# EAGLE design perfect_cubev2 (EAGLE 9.5.1)
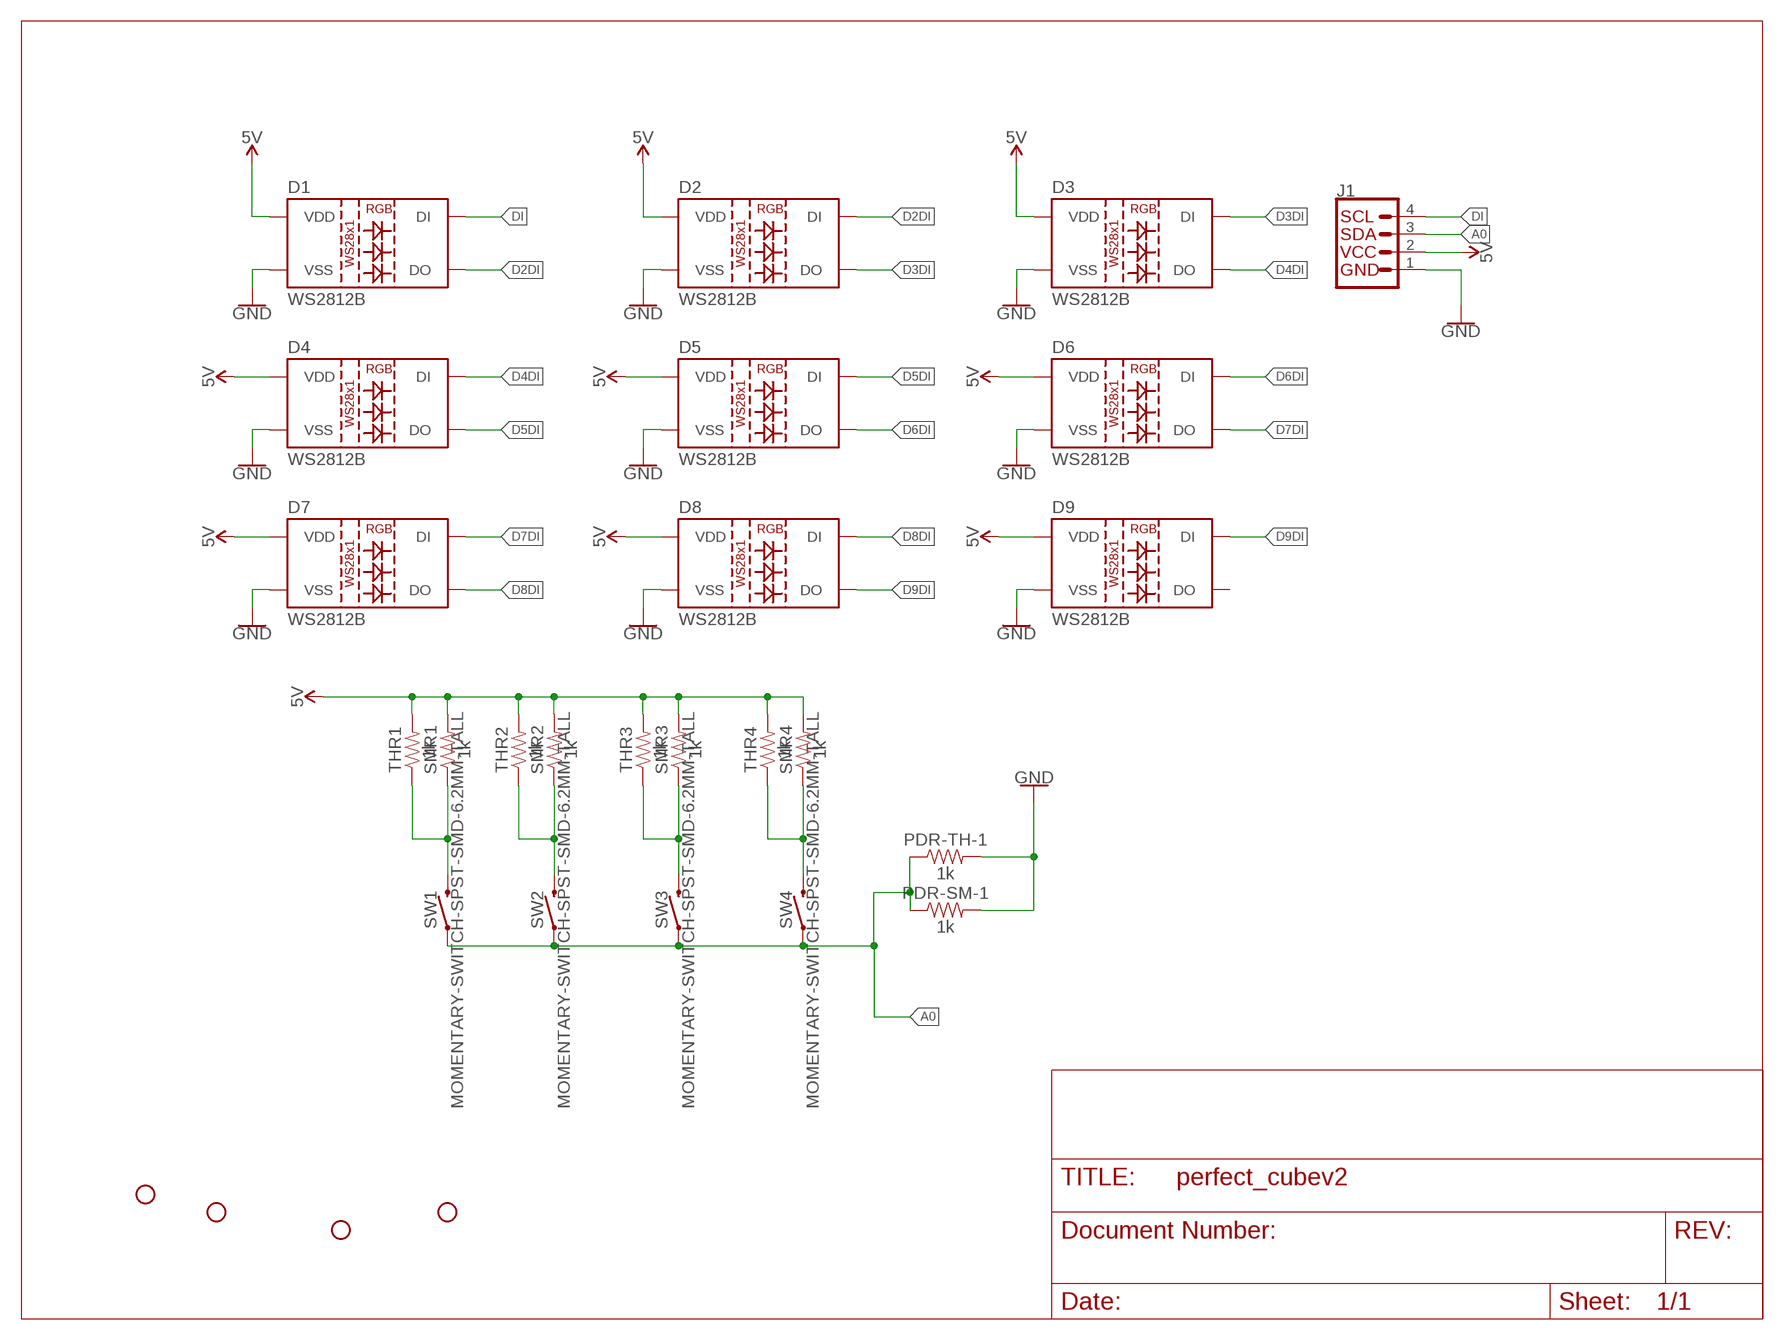
[diagram p0: schematic, sheet 1]

## Parts
D1  WS2812B  [WS2812B]
D2  WS2812B  [WS2812B]
D3  WS2812B  [WS2812B]
D4  WS2812B  [WS2812B]
D5  WS2812B  [WS2812B]
D6  WS2812B  [WS2812B]
D7  WS2812B  [WS2812B]
D8  WS2812B  [WS2812B]
D9  WS2812B  [WS2812B]
H1  STAND-OFF  [STAND-OFF]
H2  STAND-OFF  [STAND-OFF]
H3  STAND-OFF  [STAND-OFF]
H4  STAND-OFF  [STAND-OFF]
J1  QWIIC_CONNECTORJS-1MM  [1X04_1MM_RA]
PDR-SM-1  1k  1KOHM-0603-1/10W-1%  [0603]
PDR-TH-1  1k  1KOHM-HORIZ-1/4W-1%  [AXIAL-0.3]
SMR1  1k  1KOHM-0603-1/10W-1%  [0603]
SMR2  1k  1KOHM-0603-1/10W-1%  [0603]
SMR3  1k  1KOHM-0603-1/10W-1%  [0603]
SMR4  1k  1KOHM-0603-1/10W-1%  [0603]
SW1  MOMENTARY-SWITCH-SPST-SMD-6.2MM-TALL  [TACTILE_SWITCH_SMD_6.2MM_TALL]
SW2  MOMENTARY-SWITCH-SPST-SMD-6.2MM-TALL  [TACTILE_SWITCH_SMD_6.2MM_TALL]
SW3  MOMENTARY-SWITCH-SPST-SMD-6.2MM-TALL  [TACTILE_SWITCH_SMD_6.2MM_TALL]
SW4  MOMENTARY-SWITCH-SPST-SMD-6.2MM-TALL  [TACTILE_SWITCH_SMD_6.2MM_TALL]
THR1  1k  1KOHM-HORIZ-1/4W-1%  [AXIAL-0.3]
THR2  1k  1KOHM-HORIZ-1/4W-1%  [AXIAL-0.3]
THR3  1k  1KOHM-HORIZ-1/4W-1%  [AXIAL-0.3]
THR4  1k  1KOHM-HORIZ-1/4W-1%  [AXIAL-0.3]

## Nets
5V: D1.1(VDD) D2.1(VDD) D3.1(VDD) D4.1(VDD) D5.1(VDD) D6.1(VDD) D7.1(VDD) D8.1(VDD) D9.1(VDD) J1.2(VCC) SMR1.2 SMR2.2 SMR3.2 SMR4.2 THR1.P$2 THR2.P$2 THR3.P$2 THR4.P$2
A0: J1.3(SDA) PDR-SM-1.1 PDR-TH-1.P$1 SW1.A2 SW2.A2 SW3.A2 SW4.A2
D2DI: D1.2(DO) D2.4(DI)
D3DI: D2.2(DO) D3.4(DI)
D4DI: D3.2(DO) D4.4(DI)
D5DI: D4.2(DO) D5.4(DI)
D6DI: D5.2(DO) D6.4(DI)
D7DI: D6.2(DO) D7.4(DI)
D8DI: D7.2(DO) D8.4(DI)
D9DI: D8.2(DO) D9.4(DI)
DI: D1.4(DI) J1.4(SCL)
GND: D1.3(VSS) D2.3(VSS) D3.3(VSS) D4.3(VSS) D5.3(VSS) D6.3(VSS) D7.3(VSS) D8.3(VSS) D9.3(VSS) J1.1(GND) PDR-SM-1.2 PDR-TH-1.P$2
N$1: SMR1.1 SW1.B2 THR1.P$1
N$3: SMR2.1 SW2.B2 THR2.P$1
N$4: SMR3.1 SW3.B2 THR3.P$1
N$5: SMR4.1 SW4.B2 THR4.P$1
Unconnected: D9.2(DO)

## Library data of the parts
D1-D9 = SparkFun-LED:WS2812B: WS2812B SMD addressable RGB LED 5x5mm SMD LED with built-in controller IC. Color: Red/Green/Blue mC Rating: RGB: 390, 660, 180 mcd Forward Voltage: RGB: 2.0, 3.0, 3.0 V Packages:WS2812B SparkFun Products: Blynk Board - ESP8266 <https://www.sparkfun.com/products/13794>; PROD_ID: DIO-12503
H1-H4 = SparkFun-Hardware:STAND-OFF: Stand Off Drill holes for mechanically mounting via screws, standoffs, etc. Note: Use the keepout ring to avoid running the screw head into surrounding components. Variant Overviews STAND-OFF - Mechanical footprint for a #4 phillips button head screw. STAND-OFF-TIGHT - Mechanical footprint for a #4 phillips button head screw, Example SparkFun Products Screw - Phillips Head (1/4", 4-40, 10 pack) <https://www.sparkfun.com/products/10453> (PRT-10453) Screw - Phillips Head (1/2", 4-40, 10 pack) <https://www.sparkfun.com/products/10452> (PRT-10452) Screw - Phillips Head (3/4", 4-40, 10 pack) <https://www.sparkfun.com/products/10451> (PRT-10451) Screw - Phillips Head (1", 4-40, 10 pack) <https://www.sparkfun.com/products/10450> (PRT-10450)
J1 = SparkFun-Connectors:QWIIC_CONNECTOR: SparkFun I2C Standard Qwiic Connector An SMD 1mm pitch JST connector makes it easy and quick (get it? Qwiic?) to connect I2C devices to each other. The Qwiic system <http://www.sparkfun.com/qwiic> enables fast and solderless connection between popular platforms and various sensors and actuators. We carry 200mm <https://www.sparkfun.com/products/14204>, 100mm <https://www.sparkfun.com/products/14205>, 50mm <https://www.sparkfun.com/products/14206>, and breadboard friendly <https://www.sparkfun.com/products/14207> Qwiic cables. We also offer 10 pcs strips <https://www.sparkfun.com/products/14323> the SMD connectors.
PDR-SM-1 SMR1-SMR4 = SparkFun-Resistors:1KOHM: 1kΩ resistor A resistor is a passive two-terminal electrical component that implements electrical resistance as a circuit element. Resistors act to reduce current flow, and, at the same time, act to lower voltage levels within circuits. - Wikipedia; PROD_ID: RES-07856
PDR-TH-1 THR1-THR4 = SparkFun-Resistors:1KOHM: 1kΩ resistor A resistor is a passive two-terminal electrical component that implements electrical resistance as a circuit element. Resistors act to reduce current flow, and, at the same time, act to lower voltage levels within circuits. - Wikipedia; PROD_ID: RES-12182
SW1-SW4 = SparkFun-Switches:MOMENTARY-SWITCH-SPST: Momentary Switch (Pushbutton) - SPST Normally-open (NO) SPST momentary switches (buttons, pushbuttons). Variants PTH-12MM - 12mm square, through-hole Momentary Pushbutton Switch - 12mm Square <https://www.sparkfun.com/products/9190> (COM-09190) PTH-6.0MM, PTH-6.0MM-KIT - 6.0mm square, through-hole Mini Pushbutton Switch <https://www.sparkfun.com/products/97> (COM-00097) KIT package intended for soldering kit's - only one side of pads' copper is exposed. PTH-RIGHT-ANGLE-KIT - Right-angle, through-hole Right Angle Tactile Button <https://www.sparkfun.com/products/10791> - Used on SparkFun BigTime Watch Kit <https://www.sparkfun.com/products/11734> SMD-12MM - 12mm square, surface-mount Tactile Button - SMD (12mm) <https://www.sparkfun.com/products/12993> (COM-12993) Used on SparkFun PicoBoard <https://www.sparkfun.com/products/11888> SMD-4.5MM - 4.5mm Square Trackball Switch Used on SparkFun Blackberry Trackballer Breakout <https://www.sparkfun.com/products/13169> SMD-4.6MMX2.8MM - 4.60mm x 2.80mm, surface mount Used on SparkFun SAMD21 Mini Breakout <https://www.sparkfun.com/products/13664> SMD-5.2MM, SMD-5.2-REDUNDANT - 5.2mm square, surface-mount Mini Pushbutton Switch - SMD <https://www.sparkfun.com/products/8720> (COM-08720) Used on Arduino Pro Mini <https://www.sparkfun.com/products/11114> REDUNDANT package connects both switch circuits together SMD-6.0X3.5MM - 6.0 x 3.5mm, surface mount Momentary Reset Switch SMD <https://www.sparkfun.com/products/8229> (COM-08229) SMD-6.2MM-TALL - 6.2mm square, surface mount Tactile Button - SMD (6mm) <https://www.sparkfun.com/products/12992> Used on SparkFun Digital Sandbox <https://www.sparkfun.com/products/12651> SMD-RIGHT-ANGLE - Right-angle, surface mount Used on SparkFun Block for Intel® Edison - Arduino <https://www.sparkfun.com/products/13036>; PROD_ID: SWCH-11966; SF_SKU: COM-12992

## Board
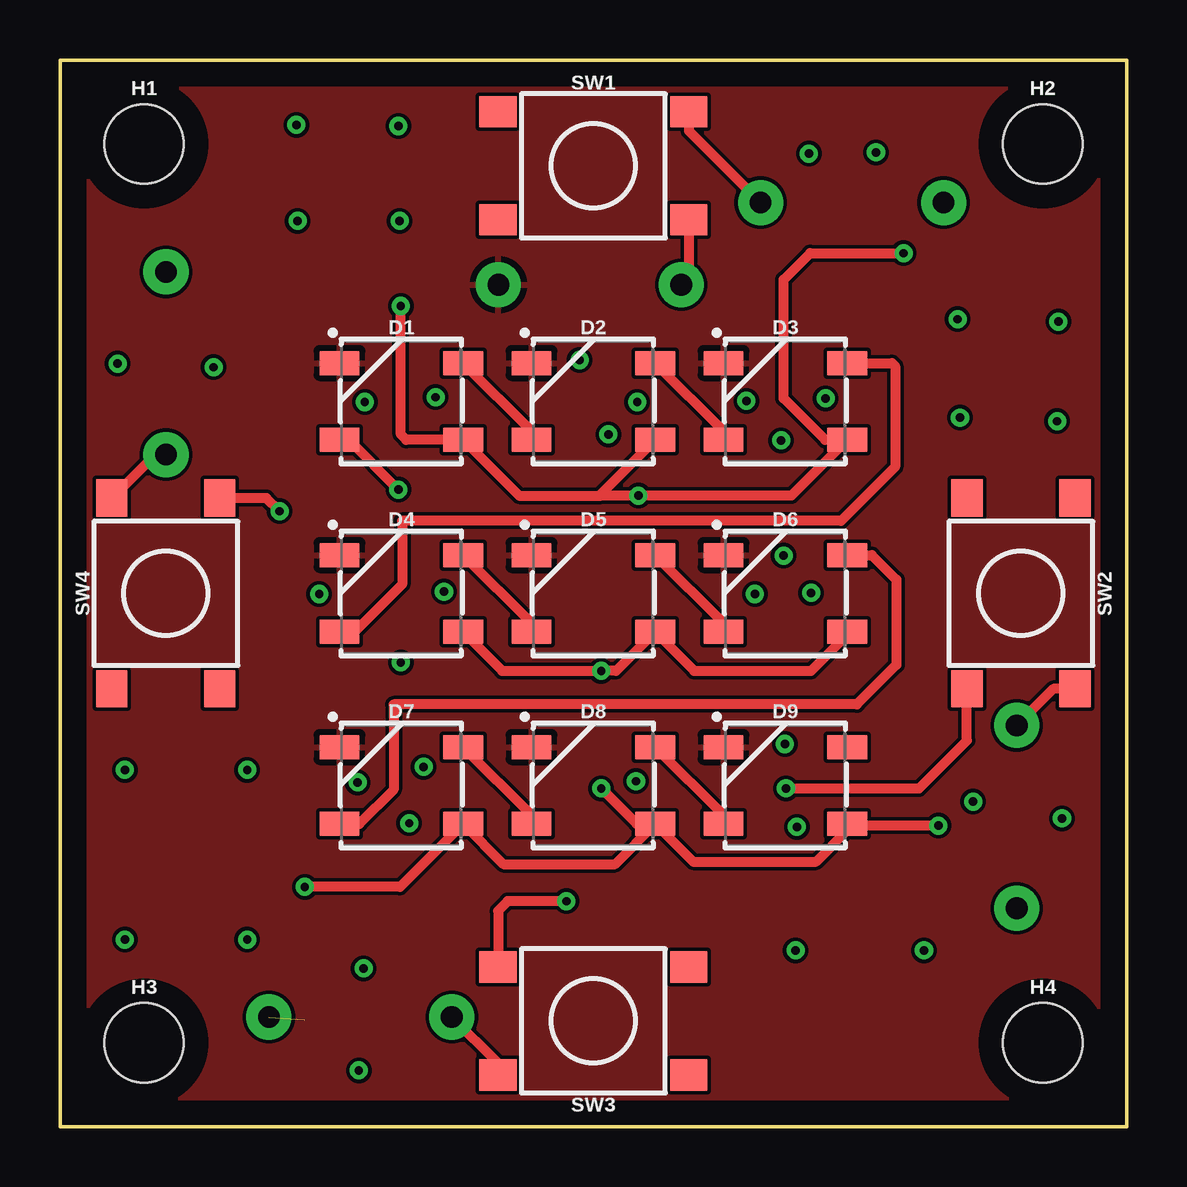
[diagram p1: board, top side]
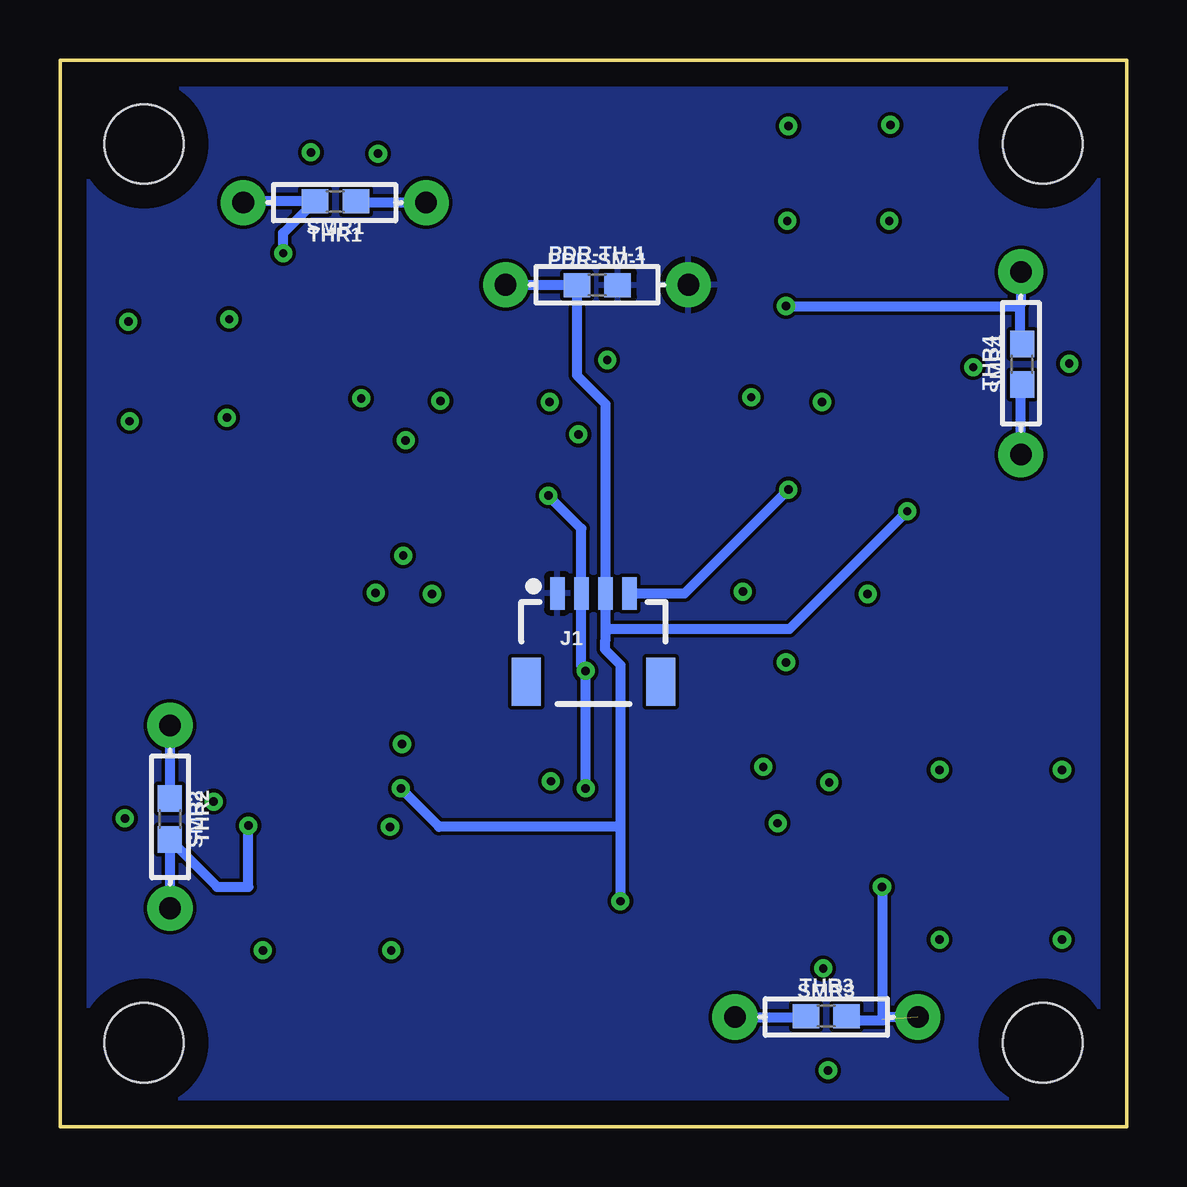
[diagram p2: board, bottom side, seen from below]

Size 44.45 x 44.45 mm. Coordinates in mm from the lower left corner, seen from the top.
Outline: 0,0 0,44.45 44.45,44.45 44.45,0 0,0
Copper layers (1*16): Top 0.035mm / dielectric 1.5mm / Bottom 0.035mm
Design rules "default": minimum track width 6mil, minimum drill 0.35mm, track to track 6mil, track to pad 6mil, pad to pad 6mil, via to via 6mil, smd to smd 6mil, copper to edge 40mil, drill to drill 6mil, minimum pad ring 10mil, minimum via ring 8mil, stop-mask expansion 4mil, vias tented up to drill 0mil, thermal gap 10mil

### Footprints (pad centres in the part's own frame; a part is rotated, then mirrored left to right if it is on the bottom)
WS2812B = smd 1.651 x 1: 1 2.577,-1.6; 2 2.577,1.6; 3 -2.577,1.6; 4 -2.577,-1.6
STAND-OFF = hole 3.302: 0,0
1X04_1MM_RA = smd 0.6 x 1.35: 1 -1.5,0; 2 -0.5,0; 3 0.5,0; 4 1.5,0 | smd 1.2 x 2: NC1 2.8,-3.675; NC2 -2.8,-3.675
0603 = smd 1.1 x 1: 1 -0.85,0; 2 0.85,0
AXIAL-0.3 = drill 0.9 pad 1.88: P$1 -3.81,0; P$2 3.81,0
TACTILE_SWITCH_SMD_6.2MM_TALL = smd 1.55 x 1.3: A1 -3.975,-2.25; A2 3.975,-2.25; B1 -3.975,2.25; B2 3.975,2.25

### Placement (x,y rotation side)
D1  14.22,30.23 0 top
D2  22.23,30.23 0 top
D3  30.23,30.23 0 top
D4  14.22,22.23 0 top
D5  22.23,22.23 0 top
D6  30.23,22.23 0 top
D7  14.22,14.22 0 top
D8  22.23,14.22 0 top
D9  30.23,14.22 0 top
H1  3.5,40.95 0 top
H2  40.95,40.95 0 top
H3  3.5,3.5 0 top
H4  40.95,3.5 0 top
J1  22.23,22.23 0 bottom
PDR-SM-1  22.07,35.06 0 bottom
PDR-TH-1  22.07,35.09 0 bottom
SMR1  32.98,38.56 180 bottom
SMR2  39.88,12.82 270 bottom
SMR3  12.53,4.62 0 bottom
SMR4  4.36,31.77 90 bottom
SW1  22.23,40.04 0 top
SW2  40.04,22.23 270 top
SW3  22.23,4.41 180 top
SW4  4.41,22.23 90 top
THR1  33.01,38.51 180 bottom
THR2  39.87,12.91 270 bottom
THR3  12.52,4.58 0 bottom
THR4  4.42,31.82 90 bottom

### Tracks (layer width: path | path; a pad name or v marks a point on that pad's centre or on a via)
5V  (via drill 0.35)  (1 unrouted)
  Top 0.406: 22.55,26.3 19.13,26.3 D1.1 14.43,28.62 14.2,28.85 v14.2,34.2 | D2.1 22.55,26.37 22.55,26.3 | 22.55,26.3 v24.1,26.3 30.48,26.3 D3.1 31.88,28.62 30.15,30.35 30.15,35.3 31.25,36.4 v35.15,36.4 | D4.1 18.43,19 v22.55,19 23.18,19 D5.1 26.43,19 31.3,19 32.8,20.5 D6.1 | D8.1 23.13,10.95 18.48,10.95 D7.1 14.18,10 v10.2,10 | D8.1 26.38,11.05 31.5,11.05 32.8,12.35 D9.1 32.88,12.55 v36.6,12.55 | D8.1 24.02,12.62 v22.55,14.1
  Bottom 0.406: THR4.P$2 4.42,34.28 4.46,34.23 | 4.46,34.23 4.46,32.52 SMR4.2 | THR1.P$2 36.76,38.56 SMR1.2 35.15,37.24 v35.15,36.4 | THR2.P$2 39.87,11.96 SMR2.2 37.9,10 36.6,10 v36.6,12.55 | THR3.P$2 10.2,4.58 v10.2,10 | SMR3.2 11.87,4.42 10.16,4.42 10.2,4.46 | v22.55,14.1 v22.55,19 22.73,19.18 J1.2 22.73,24.93 v24.1,26.3 | v14.2,34.2 4.5,34.2 4.46,34.23
A0  (via drill 0.35)
  Top 0.406: SW1.A2 26.2,35.4 PDR-TH-1.P$1 | v21.1,9.4 18.65,9.4 18.25,9 SW3.A2 | v9.15,25.65 8.6,26.2 SW4.A2 | v30.25,14.1 35.8,14.1 37.79,16.09 SW2.A2
  Bottom 0.406: PDR-TH-1.P$1 22.93,35.09 PDR-SM-1.1 22.91,31.32 21.73,30.12 J1.3 21.73,20.6 | 21.73,20.6 21.73,20.27 21.75,20.25 21.75,19.9 21.1,19.25 21.1,12.5 | 21.1,12.5 v21.1,9.4 | 21.73,20.6 21.57,20.75 14.05,20.75 v9.15,25.65 | 21.1,12.5 28.65,12.5 v30.25,14.1
D2DI
  Top 0.406: D1.2 19.65,28.98 D2.4
D3DI
  Top 0.406: D2.2 27.65,28.98 D3.4
D4DI
  Top 0.406: D3.2 34.67,31.82 34.8,31.7 34.8,27.5 32.55,25.25 14.25,25.25 14.25,22.6 12.28,20.62 D4.4
D5DI
  Top 0.406: D4.2 19.65,20.98 D5.4
D6DI
  Top 0.406: D5.2 27.65,20.98 D6.4
D7DI
  Top 0.406: D6.2 33.83,23.82 34.85,22.8 34.85,19.25 33.2,17.6 13.9,17.6 13.9,14.05 12.47,12.62 D7.4
D8DI
  Top 0.406: D7.2 19.65,12.98 D8.4
D9DI
  Top 0.406: D8.2 27.65,12.98 D9.4
DI  (via drill 0.35)
  Top 0.406: v14.1,26.55 12.03,28.62 D1.4
  Bottom 0.406: J1.4 18.43,22.23 v14.1,26.55
GND
  pour Top: 0,44 44,44 44,0 0,0
  pour Bottom: 0,44 44,44 44,0 0,0
N$1
  Top 0.406: SW1.B2 26.2,41.5 THR1.P$1
  Bottom 0.406: THR1.P$1 32.06,38.51 SMR1.1
N$2  (via drill 0.35)
  other vias: 2.7,7.8
N$3
  Top 0.406: SW2.B2 41.39,18.25 THR2.P$1
  Bottom 0.406: THR2.P$1 SMR2.1
N$4
  Top 0.406: SW3.B2 18.25,2.65 THR3.P$1
  Bottom 0.406: THR3.P$1 13.41,4.58 SMR3.1
N$5
  Top 0.406: SW4.B2 3.97,28 THR4.P$1
  Bottom 0.406: THR4.P$1 4.42,30.86 SMR4.1
N$6  (via drill 0.35)
  other vias: 7.8,7.8
N$7  (via drill 0.35)
  other vias: 2.7,14.88
N$8  (via drill 0.35)
  other vias: 7.8,14.88
N$9  (via drill 0.35)
  other vias: 30.65,7.35
N$10  (via drill 0.35)
  other vias: 36,7.35
N$11  (via drill 0.35)
  other vias: 37.5,29.55
N$12  (via drill 0.35)
  other vias: 37.4,33.65
N$13  (via drill 0.35)
  other vias: 41.6,33.55
N$14  (via drill 0.35)
  other vias: 41.55,29.4
N$15  (via drill 0.35)
  other vias: 14.15,37.75
N$16  (via drill 0.35)
  other vias: 9.9,37.75
N$17  (via drill 0.35)
  other vias: 9.85,41.75
N$18  (via drill 0.35)
  other vias: 14.1,41.7
N$19  (via drill 0.35)
  other vias: 24.05,30.2
N$20  (via drill 0.35)
  other vias: 22.85,28.85
N$21  (via drill 0.35)
  other vias: 21.65,31.95
N$22  (via drill 0.35)
  other vias: 30.05,28.6
N$23  (via drill 0.35)
  other vias: 28.6,30.25
N$24  (via drill 0.35)
  other vias: 31.9,30.35
N$25  (via drill 0.35)
  other vias: 12.7,30.2
N$26  (via drill 0.35)
  other vias: 15.65,30.4
N$28  (via drill 0.35)
  other vias: 16,22.3
N$29  (via drill 0.35)
  other vias: 14.2,19.35
N$30  (via drill 0.35)
  other vias: 10.8,22.2
N$31  (via drill 0.35)
  other vias: 30.15,23.8
N$32  (via drill 0.35)
  other vias: 28.95,22.2
N$33  (via drill 0.35)
  other vias: 31.3,22.25
N$34  (via drill 0.35)
  other vias: 30.2,15.95
N$35  (via drill 0.35)
  other vias: 30.7,12.5
N$36  (via drill 0.35)
  other vias: 24,14.4
N$37  (via drill 0.35)
  other vias: 15.15,15
N$38  (via drill 0.35)
  other vias: 14.55,12.65
N$39  (via drill 0.35)
  other vias: 12.4,14.35
N$40  (via drill 0.35)
  other vias: 6.4,31.65
N$41  (via drill 0.35)
  other vias: 31.2,40.55
N$42  (via drill 0.35)
  other vias: 41.75,12.85
N$43  (via drill 0.35)
  other vias: 12.65,6.6
N$44  (via drill 0.35)
  other vias: 2.4,31.8
N$45  (via drill 0.35)
  other vias: 34,40.6
N$46  (via drill 0.35)
  other vias: 12.45,2.35
N$47  (via drill 0.35)
  other vias: 38.05,13.55